# EAGLE schematic Main-Unit-Schematic (EAGLE 9.6.2)
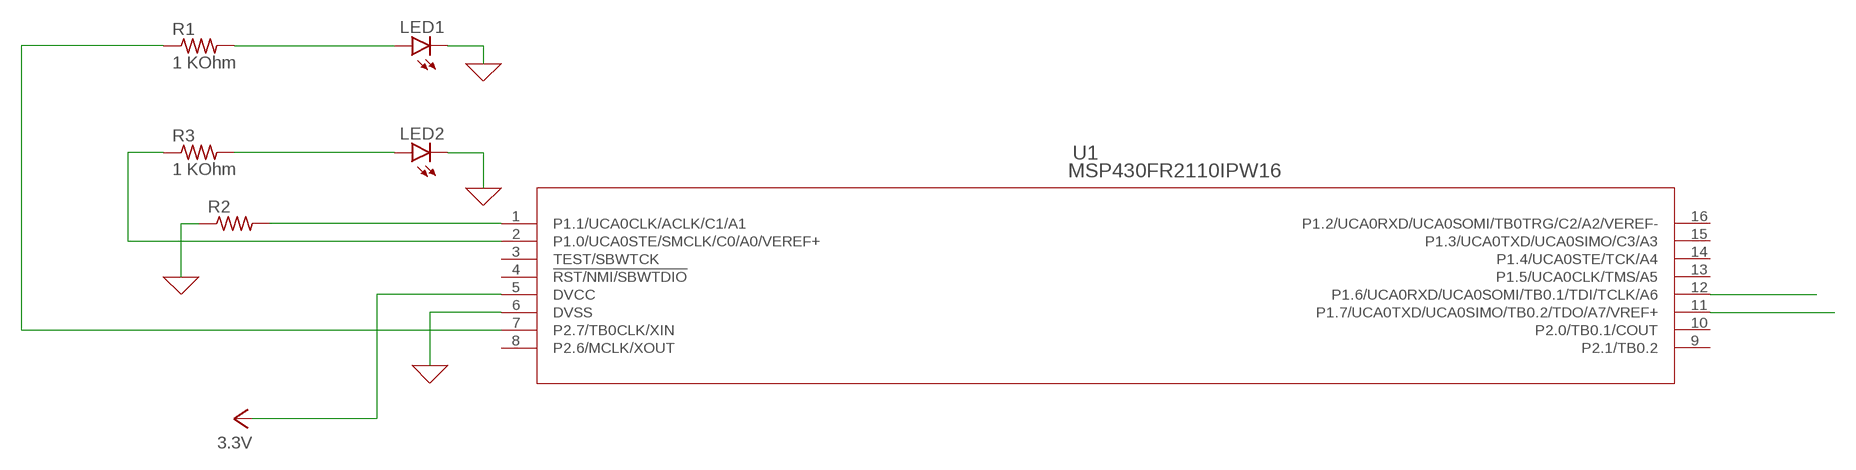
[diagram p0: schematic, sheet 1]

## Parts
LED1  LED5MM  [LED5MM]
LED2  LED5MM  [LED5MM]
R1  1 KOhm  R-US_0204/7  [0204/7]
R2  R-US_0204/7  [0204/7]
R3  1 KOhm  R-US_0204/7  [0204/7]
U1  MSP430FR2110IPW16  [PW16_TEX]

## Nets
0: LED1.K(C) LED2.K(C) R2.1 U1.6(DVSS) ; supply symbol labelled GND
N$1: U1.12(P1.6/UCA0RXD/UCA0SOMI/TB0.1/TDI/TCLK/A6)
N$2: U1.11(P1.7/UCA0TXD/UCA0SIMO/TB0.2/TDO/A7/VREF+)
N$3: R2.2 U1.1(P1.1/UCA0CLK/ACLK/C1/A1)
N$4: R1.1 U1.7(P2.7/TB0CLK/XIN)
N$5: R3.1 U1.2(P1.0/UCA0STE/SMCLK/C0/A0/VEREF+)
N$6: LED1.A R1.2
N$7: LED2.A R3.2
VCC: U1.5(DVCC) ; supply symbol labelled 3.3V
Unconnected: U1.3(TEST/SBWTCK) U1.4(!RST/NMI/SBWTDIO) U1.8(P2.6/MCLK/XOUT) U1.9(P2.1/TB0.2) U1.10(P2.0/TB0.1/COUT) U1.13(P1.5/UCA0CLK/TMS/A5) U1.14(P1.4/UCA0STE/TCK/A4) U1.15(P1.3/UCA0TXD/UCA0SIMO/C3/A3) U1.16(P1.2/UCA0RXD/UCA0SOMI/TB0TRG/C2/A2/VEREF-)

## Library data of the parts
LED1 LED2 = led:LED: LED OSRAM: - CHIPLED LG R971, LG N971, LY N971, LG Q971, LY Q971, LO R971, LY R971 LH N974, LH R974 LS Q976, LO Q976, LY Q976 LO Q996 - Hyper CHIPLED LW Q18S LB Q993, LB Q99A, LB R99A - SideLED LS A670, LO A670, LY A670, LG A670, LP A670 LB A673, LV A673, LT A673, LW A673 LH A674 LY A675 LS A676, LA A676, LO A676, LY A676, LW A676 LS A679, LY A679, LG A679 - Hyper Micro SIDELED® LS Y876, LA Y876, LO Y876, LY Y876 LT Y87S - SmartLED LW L88C, LW L88S LB L89C, LB L89S, LG L890 LS L89K, LO L89K, LY L89K LS L896, LA L896, LO L896, LY L896 - TOPLED LS T670, LO T670, LY T670, LG T670, LP T670 LSG T670, LSP T670, LSY T670, LOP T670, LYG T670 LG T671, LOG T671, LSG T671 LB T673, LV T673, LT T673, LW T673 LH T674 LS T676, LA T676, LO T676, LY T676, LB T676, LH T676, LSB T676, LW T676 LB T67C, LV T67C, LT T67C, LS T67K, LO T67K, LY T67K, LW E67C LS E67B, LA E67B, LO E67B, LY E67B, LB E67C, LV E67C, LT E67C LW T67C LS T679, LY T679, LG T679 LS T770, LO T770, LY T770, LG T770, LP T770 LB T773, LV T773, LT T773, LW T773 LH T774 LS E675, LA E675, LY E675, LS T675 LS T776, LA T776, LO T776, LY T776, LB T776 LHGB T686 LT T68C, LB T68C - Hyper Mini TOPLED® LB M676 - Mini TOPLED Santana® LG M470 LS M47K, LO M47K, LY M47K Source: http://www.osram.convergy.de LUXEON: - LUMILED® LXK2-PW12-R00, LXK2-PW12-S00, LXK2-PW14-U00, LXK2-PW14-V00 LXK2-PM12-R00, LXK2-PM12-S00, LXK2-PM14-U00 LXK2-PE12-Q00, LXK2-PE12-R00, LXK2-PE12-S00, LXK2-PE14-T00, LXK2-PE14-U00 LXK2-PB12-K00, LXK2-PB12-L00, LXK2-PB12-M00, LXK2-PB14-N00, LXK2-PB14-P00, LXK2-PB14-Q00 LXK2-PR12-L00, LXK2-PR12-M00, LXK2-PR14-Q00, LXK2-PR14-R00 LXK2-PD12-Q00, LXK2-PD12-R00, LXK2-PD12-S00 LXK2-PH12-R00, LXK2-PH12-S00 LXK2-PL12-P00, LXK2-PL12-Q00, LXK2-PL12-R00 Source: www.luxeon.com KINGBRIGHT: KA-3528ASYC Source: www.kingbright.com
R1-R3 = rcl:R-US_: RESISTOR, American symbol; SPICEPREFIX: R
U1 = MSP430FR2110:MSP430FR2110IPW16; COPYRIGHT: Copyright (C) 2023 Ultra Librarian. All rights reserved.; MANUFACTURER_PART_NUMBER: MSP430FR2110IPW16; MFR_NAME: Texas Instruments